# Altium schematic sheet VoiceRecorderSchematic.SchDoc: Voice Recorder
size A; Date: 09/08/2021; CompanyName: Group-24; DrawnBy: Thanushan K., Nisitha Maneesha,; DocumentNumber: Voice Recorder PCB; Revision: 1; SheetNumber: 1
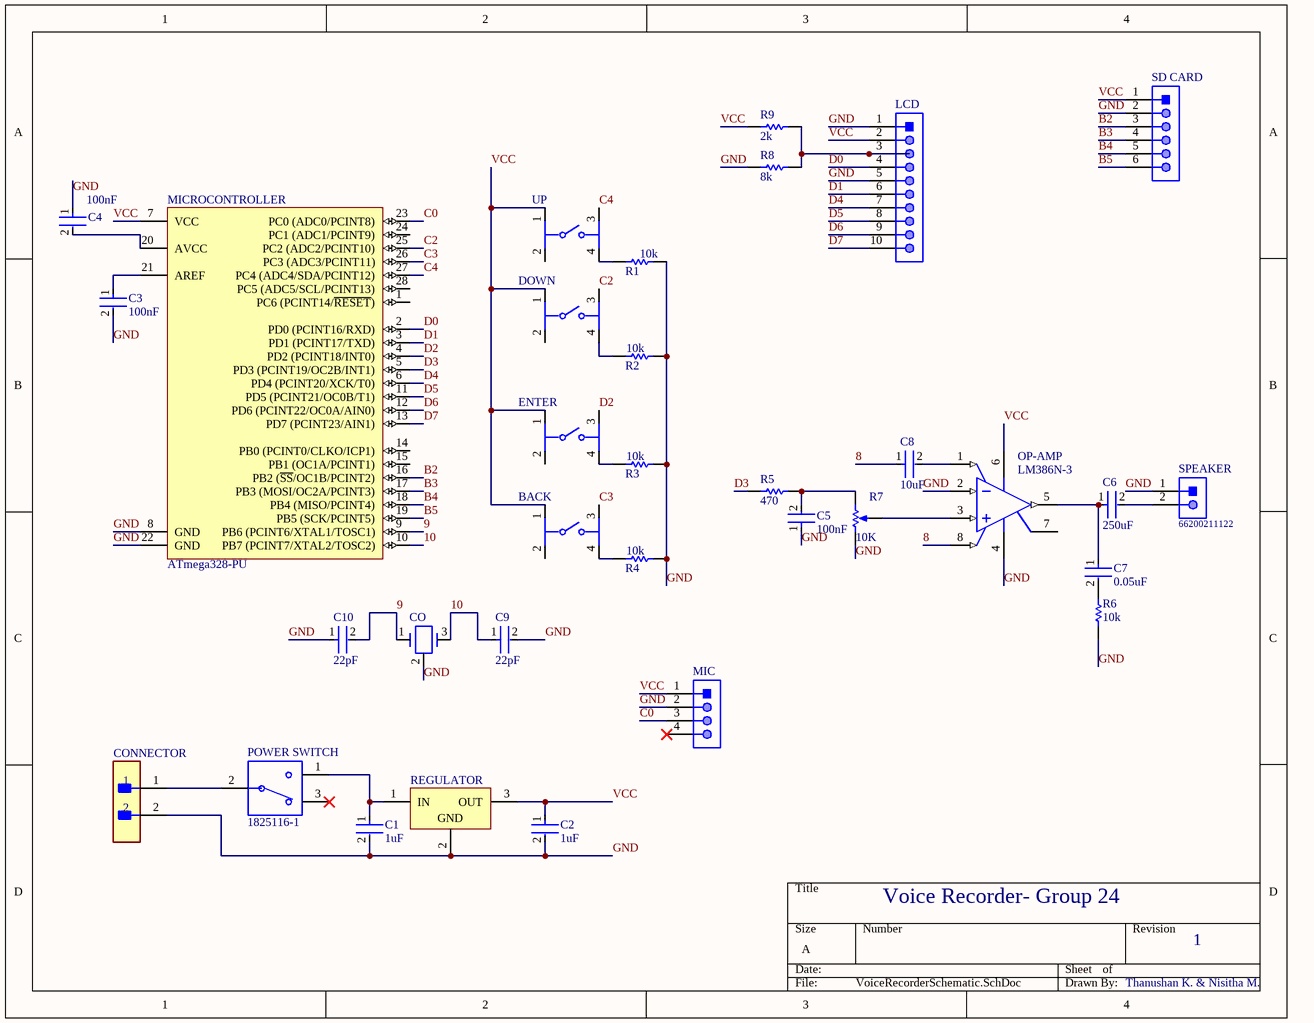
[diagram p0: VoiceRecorderSchematic.SchDoc]

## Parts
BACK  3-1825910-1  [FP-3-1825910-1-MFG]  (value not drawn)
C1  1uF  [FP-C440-MFG]
C2  1uF  [FP-C440-MFG]
C3  100nF  [FP-C440-MFG]
C4  100nF  [FP-C440-MFG]
C5  100nF  [FP-C440-MFG]
C6  250uF  [FP-C440-MFG]
C7  0.05uF  [FP-C440-MFG]
C8  10uF  [FP-C440-MFG]
C9  22pF  [FP-C440-MFG]
C10  22pF  [FP-C440-MFG]
CO  ECS-200-20-4X  [ECS-4X-3IL]  (value not drawn)
CONNECTOR  350428-1  [FP-350428-1-MFG]  (value not drawn)
DOWN  3-1825910-1  [FP-3-1825910-1-MFG]  (value not drawn)
ENTER  3-1825910-1  [FP-3-1825910-1-MFG]  (value not drawn)
LCD  66201011122  [66201011122]  (value not drawn)
MIC  66200411122  [66200411122]  (value not drawn)
MICROCONTROLLER  ATmega328-PU  [28P3]
OP-AMP  LM386N-3  [TI-P8]
POWER_SWITCH  1825116-1  [SW_1825116-1]
R1  10k  [OMTE-RES7X2.5-2]
R2  10k  [OMTE-RES7X2.5-2]
R3  10k  [OMTE-RES7X2.5-2]
R4  10k  [OMTE-RES7X2.5-2]
R5  470  [OMTE-RES7X2.5-2]
R6  10k  [OMTE-RES7X2.5-2]
R7  value 10K  [VR5]  (hidden comment: RPot)
R8  8k  [OMTE-RES7X2.5-2]
R9  2k  [OMTE-RES7X2.5-2]
REGULATOR  L7805CV  [TO220]  (value not drawn)
SD_CARD  66200611122  [66200611122]  (value not drawn)
SPEAKER  66200211122  [66200211122]
UP  3-1825910-1  [FP-3-1825910-1-MFG]  (value not drawn)

## Nets
8: C8.1 OP-AMP.8(GAIN)
9: C10.2 CO.1 MICROCONTROLLER.9(PB6_(PCINT6/XTAL1/TOSC1))
10: C9.1 CO.3 MICROCONTROLLER.10(PB7_(PCINT7/XTAL2/TOSC2))
B2: MICROCONTROLLER.16(PB2_(~{SS}/OC1B/PCINT2)) SD_CARD.3
B3: MICROCONTROLLER.17(PB3_(MOSI/OC2A/PCINT3)) SD_CARD.4
B4: MICROCONTROLLER.18(PB4_(MISO/PCINT4)) SD_CARD.5
B5: MICROCONTROLLER.19(PB5_(SCK/PCINT5)) SD_CARD.6
C0: MIC.3 MICROCONTROLLER.23(PC0_(ADC0/PCINT8))
C2: DOWN.3 MICROCONTROLLER.25(PC2_(ADC2/PCINT10))
C3: BACK.3 MICROCONTROLLER.26(PC3_(ADC3/PCINT11))
C4: MICROCONTROLLER.27(PC4_(ADC4/SDA/PCINT12)) UP.3
D0: LCD.4 MICROCONTROLLER.2(PD0_(PCINT16/RXD))
D1: LCD.6 MICROCONTROLLER.3(PD1_(PCINT17/TXD))
D2: ENTER.3 MICROCONTROLLER.4(PD2_(PCINT18/INT0))
D3: MICROCONTROLLER.5(PD3_(PCINT19/OC2B/INT1)) R5.2
D4: LCD.7 MICROCONTROLLER.6(PD4_(PCINT20/XCK/T0))
D5: LCD.8 MICROCONTROLLER.11(PD5_(PCINT21/OC0B/T1))
D6: LCD.9 MICROCONTROLLER.12(PD6_(PCINT22/OC0A/AIN0))
D7: LCD.10 MICROCONTROLLER.13(PD7_(PCINT23/AIN1))
GND: C1.2 C2.2 C3.2 C4.1 C5.1 C9.2 C10.1 CO.2 CONNECTOR.2 LCD.1 LCD.5 MIC.2 MICROCONTROLLER.8(GND) MICROCONTROLLER.22(GND) OP-AMP.2(IN-) OP-AMP.4(GND) R1.1 R2.1 R3.1 R4.1 R6.1 R7.1(TOP) R8.2 REGULATOR.2(GND) SD_CARD.2 SPEAKER.1
VCC: BACK.1 C2.1 DOWN.1 ENTER.1 LCD.2 MIC.1 MICROCONTROLLER.7(VCC) OP-AMP.6(VS) R9.2 REGULATOR.3(OUT) SD_CARD.1 UP.1
NetBACK_4: BACK.4 R4.2
NetC1_1: C1.1 POWER_SWITCH.1 REGULATOR.1(IN)
NetC3_1: C3.1 MICROCONTROLLER.21(AREF)
NetC4_2: C4.2 MICROCONTROLLER.20(AVCC)
NetC5_2: C5.2 R5.1 R7.2(BOT)
NetC6_1: C6.1 C7.1 OP-AMP.5(VOUT)
NetC6_2: C6.2 SPEAKER.2
NetC7_2: C7.2 R6.2
NetC8_2: C8.2 OP-AMP.1(GAIN)
NetCONNECTOR_1: CONNECTOR.1 POWER_SWITCH.2
NetDOWN_4: DOWN.4 R2.2
NetENTER_4: ENTER.4 R3.2
NetLCD_3: LCD.3 R8.1 R9.1
NetOP-AMP_3: OP-AMP.3(IN+) R7.3(TAP)
NetR1_2: R1.2 UP.4

Not connected (* = marked no-connect by the designer): BACK 2; DOWN 2; ENTER 2; MIC 4*; MICROCONTROLLER 1(PC6_(PCINT14/~{RESET})) 14(PB0_(PCINT0/CLKO/ICP1)) 15(PB1_(OC1A/PCINT1)) 24(PC1_(ADC1/PCINT9)) 28(PC5_(ADC5/SCL/PCINT13)); OP-AMP 7(BYPASS); POWER_SWITCH 3*; UP 2

## Notes on the sheet
- Voice Recorder- Group 24
- 1
- Thanushan K. & Nisitha M.

## Library data of the parts
BACK DOWN ENTER UP = CMP-03407-000001-1: SWITCH TACTILE SPST-NO 0.05A 24V; Manufacturer: TE Connectivity; Operating Force: 160gf; Contact Current Rating: 50mA; Contact Resistance: 100mΩ; Electromechanical Life: 100000Cycles; Device Class L1: Electromechanical; ComponentLink2URL: https://www.te.com/commerce/DocumentDelivery/DDEController?Action=srchrtrv&DocNm=1825910&DocType=Customer+Drawing&DocLang=English; Category: Switch; Device Class L2: Switches; Temperature: -35°C to +85°C; RoHS: TRUE; Mount: Through Hole; Manufacturer Part Number: 3-1825910-1; Automotive: No; Lead Free: Yes; Device Class L3: Tactile Switches; ComponentLink2Description: Datasheet; Temperature Range High: +85°C; Height: 17.3mm; Package: 0; Temperature Range Low: -35°C; Throw Configuration: SPST-NO; Digikey Description: SWITCH TACTILE SPST-NO 0.05A 24V; Octopart: https://octopart.com/3-1825910-1-te+connectivity-46506874
C1-C10 = CMP-03020-013956-1: CAP CER 1UF 50V Z5U AXIAL; Manufacturer Part Number: C440C105M5U5TA7200; Manufacturer: Kemet; Material: Ceramic; Tolerance: 20%; Mouser Description: Multilayer Ceramic Capacitors MLCC - Leaded 50volts 1uF 20%; Temperature Range High: +85°C; Lead Free: Yes; Height: 3.81mm; Category: Cap; ComponentLink2Description: Datasheet; Temperature: -10°C to +85°C; Ipc Land Pattern Name: CAPAD1043W70L736D381; Device Class L3: Ceramic Capacitors; Octopart: https://octopart.com/c440c105m5u5ta7200-kemet-193612; RoHS: TRUE; Automotive: No; Temperature Characteristic: Z5U; ComponentLink2URL: https://content.kemet.com/datasheets/KEM_C1042_AXIMAX_Z5U.pdf; Value: 1uF; Package: C440; Temperature Range Low: -10°C; Capacitance: 1uF; Device Class L2: Capacitors; Device Class L1: Passive Components; Digikey Description: CAP CER 1UF 50V Z5U AXIAL; Voltage Rating: 50V
CO = CMP-1669-00001-2: CRYSTAL 20.000MHZ 20PF 49US; Manufacturer: ECS; ComponentLink1URL: http://www.ecsxtal.com/store/pdf/hc-49usx.pdf; PartNumber: ECS-200-20-4X; ComponentLink1Description: Datasheet; PackageReference: 4X-3IL
CONNECTOR = CMP-03369-000080-1: CONN HEADER VERT 2POS 6.35MM; Manufacturer: TE Connectivity; Standoff Height: 0.63mm; Number Of Contacts: 2; Conn Gender: Male; Voltage Rating: 600V; Conn Orientation: Vertical; Current Rating: 12A; Number Of Rows: 1; Mouser Description: Connector, Soft Shell; Universal MATE-N-LOK; 2; Nylon; Natural; 19 A; 600 VAC; Height: 14.99mm; Pitch: 6.35mm; ComponentLink2URL: https://www.te.com/commerce/DocumentDelivery/DDEController?Action=showdoc&DocId=Customer+Drawing%7F350428%7FY2%7Fpdf%7FEnglish%7FENG_CD_350428_Y2.pdf%7F350428-1; Device Class L1: Connectors; Automotive: No; Octopart: https://octopart.com/350428-1-te+connectivity-46505355; Digikey Description: CONN HEADER VERT 2POS 6.35MM; RoHS: TRUE; Temperature: -40°C to +105°C; Contact Material: Gold,Nickel; Package: 350428-1; Temperature Range Low: -40°C; Device Class L3: unset; Lead Free: Yes; Device Class L2: Headers and Wire Housings; Category: Conn; ComponentLink2Description: Datasheet; Temperature Range High: +105°C; Manufacturer Part Number: 350428-1
LCD = CMP-1502-00448-1: THT Male Header WR-MPC3, Vertical, Single Row, pitch 3 mm, 10 pins; Manufacturer: Wurth Elektronik; Working Voltage: 250VAC; Pitch: 3mm; Contact Resistance: 10mOhm; Pin Number: 10; Manufacturer URL: http://www.we-online.de; Packaging: Tube; Part Number: 66201011122; Datasheet URL: https://katalog.we-online.de/em/datasheet/6620xx11122.pdf; Orientation: Vertical; Publisher: WurthElektronik; Package Reference: 66201011122; Operating Temperature: -40to105degC; Mounting Technology: THT; Gender: Male
MIC = CMP-1502-00442-1: THT Male Header WR-MPC3, Vertical, Single Row, pitch 3 mm, 4 pins; Manufacturer: Wurth Elektronik; Contact Resistance: 10mOhm; Working Voltage: 250VAC; Pin Number: 4; Pitch: 3mm; Manufacturer URL: http://www.we-online.de; Package Reference: 66200411122; Packaging: Tube; Part Number: 66200411122; Publisher: WurthElektronik; Orientation: Vertical; Mounting Technology: THT; Gender: Male; Operating Temperature: -40to105degC; Datasheet URL: https://katalog.we-online.de/em/datasheet/6620xx11122.pdf
MICROCONTROLLER = CMP-0095-00015-2: 8-bit AVR Microcontroller, 32KB Flash, 1KB EEPROM, 2KB SRAM, 28-pin PDIP, Industrial Grade (-40°C to 85°C); ComponentLink3Description: ATmega48A/48PA/88A/88PA/168A/168PA/328/328P Summary; RevisionNote: DatasheetVersion updated. URLs added.; DatasheetVersion: revD, May-2011; ComponentLink1URL: http://www.atmel.com/; PackageVersion: revB, Sep-2001; PackageDescription: 28-lead (0.300"/7.62mm Wide) Plastic Dual Inline Package (PDIP); PackageReference: 28P3; ComponentLink1Description: Manufacturer URL; ComponentLink2Description: ATmega48A/48PA/88A/88PA/168A/168PA/328/328P Datasheet; ComponentLink3URL: http://www.atmel.com/dyn/resources/prod_documents/8271S.pdf; ComponentLink2URL: http://www.atmel.com/dyn/resources/prod_documents/8271.pdf
OP-AMP = CMP-0057-00053-3: Low Voltage Audio Power Amplifier, 0 to 70 degC, 8-pin DIP (P8); Manufacturer: Texas Instruments; SubFamily: Mid/High-Power Amplifier; Input Type: Analog; Max. Number of Speaker Outputs: 1; ComponentLink1Description: Manufacturer URL; ComponentLink2Description: Datasheet; ComponentLink2URL: http://www.ti.com/general/docs/lit/getliterature.tsp?genericPartNumber=LM386&fileType=pdf; Code_JEDEC: MS-001; ComponentLink3URL: http://www.ti.com/litv/pdf/mpdi001b; Mounting Technology: Through Hole; PartNumber: LM386N-3; PackageVersion: 4040082/E, 04/2010; ComponentLink1URL: http://www.ti.com/; DatasheetVersion: SNAS545A; ComponentLink3Description: Package Specification; PackageDescription: 8-Pin Plastic In-Line, Body 9.59 x 6.35 mm, Pitch 2.54 mm; PackageReference: P8
POWER_SWITCH = 1825116-1: Slide Switch SPDT Through Hole, Right Angle; MF: TE Connectivity; Price: None; Value: *; EU_RoHS_Compliance: Compliant; MP: 1825116-1; Package: None; TE_purchase_URL: https://www.te.com/usa-en/product-1825116-1.html?te_bu=Cor&te_type=disp&te_campaign=seda_glo_cor-seda-global-disp-prtnr-fy19-seda-model-bom-cta_sma-317_1&elqCampaignId=32493; SnapEDA_Link: https://www.snapeda.com/parts/1825116-1/TE%20Connectivity%20ALCOSWITCH%20Switches/view-part/497270/?ref=snap; Availability: Unavailable
R1-R4 R6 = CMP-2000-06865-1: Little Demon(R) Carbon Composition Molded OD Series, 250 V, 10 KOhm, +/-5%, -70 to 130 degC, 2-Pin THD, RoHS, Bulk; PartNumber: OD103JE; Manufacturer: Ohmite; Power Rating: 0.25W; Power (Watts): 0.25W,1/4W; Tolerance: ±5%; Online Catalog: OD,OF,OASeries,LittleDemon®; Catalog Drawings: OD,OF,OASeries; EDA / CAD Models: DownloadfromAcceleratedDesigns; Mounting Technology: ThroughHole; Datasheet Version: 06/2016; RoHS Information: LittleDemon"E"SeriesMaterialDeclaration; Number of Terminations: 2; Temperature Coefficient: -; Height: -; Resistance (Ohms): 10k; Composition: CarbonComposition; Package Description: 2-Pin THD Resistor, Body 7 x 2.5 mm, Lead Dia. 0.6 mm; Size / Dimension: 0.098"Diax0.276"L(2.50mmx7.00mm); Category: Resistors; Manufacturer URL: http://www.ohmite.com/; Features: PulseWithstanding; Family: ThroughHoleResistors; Supplier Device Package: Axial; Package / Case: Axial; Standard Package: 100; Package Reference: RES7X2.5; Operating Temperature: -; Series: LittleDemon®OD; Datasheet URL: http://www.ohmite.com/cat/res_od_of_oa.pdf; Packaging: Bulk
R5 R8 R9 = CMP-2000-06865-1: Little Demon(R) Carbon Composition Molded OD Series, 250 V, 10 KOhm, +/-5%, -70 to 130 degC, 2-Pin THD, RoHS, Bulk; PartNumber: OD103JE; Manufacturer: Ohmite; Resistance (Ohms): 10k; Power Rating: 0.25W; Power (Watts): 0.25W,1/4W; Tolerance: ±5%; Online Catalog: OD,OF,OASeries,LittleDemon®; Catalog Drawings: OD,OF,OASeries; EDA / CAD Models: DownloadfromAcceleratedDesigns; Mounting Technology: ThroughHole; Datasheet Version: 06/2016; RoHS Information: LittleDemon"E"SeriesMaterialDeclaration; Number of Terminations: 2; Temperature Coefficient: -; Height: -; Composition: CarbonComposition; Package Description: 2-Pin THD Resistor, Body 7 x 2.5 mm, Lead Dia. 0.6 mm; Size / Dimension: 0.098"Diax0.276"L(2.50mmx7.00mm); Category: Resistors; Manufacturer URL: http://www.ohmite.com/; Features: PulseWithstanding; Family: ThroughHoleResistors; Supplier Device Package: Axial; Package / Case: Axial; Standard Package: 100; Package Reference: RES7X2.5; Operating Temperature: -; Series: LittleDemon®OD; Datasheet URL: http://www.ohmite.com/cat/res_od_of_oa.pdf; Packaging: Bulk
R7 = RPot: Potentiometer; Sim Note: Enter the Resistance value and the set point into parameter fields.; Set Position: 0.5; Published: 8-Jun-2000; LatestRevisionDate: 17-Jul-2002; LatestRevisionNote: Re-released for DXP Platform.; PackageReference: VR5; Publisher: Altium Limited; PackageDescription: Variable Resistor, Thru-Hole; 3 Leads
REGULATOR = CMP-0244-00483-1: Positive Voltage Regulator, 5V, 3-Pin TO-220; PackageDescription: TO, Thru-Hole, Vertical, Heatsink Mounted; 3 In-Line Leads; Pitch 2.54 mm; ComponentLink2Description: Datasheet; PackageReference: TO220; ComponentLink3URL: http://www.st.com/internet/com/TECHNICAL_RESOURCES/TECHNICAL_LITERATURE/PACKAGE_INFORMATION/CD00004649.pdf; DatasheetVersion: 16/11/2011; ComponentLink1Description: Manufacturer URL; ComponentLink1URL: http://www.st.com; PackageVersion: ver3.0; ComponentLink3Description: Package Specification; ComponentLink2URL: http://www.st.com/internet/com/TECHNICAL_RESOURCES/TECHNICAL_LITERATURE/DATASHEET/CD00000444.pdf
SD_CARD = CMP-1502-00444-1: THT Male Header WR-MPC3, Vertical, Single Row, pitch 3 mm, 6 pins; Manufacturer: Wurth Elektronik; Working Voltage: 250VAC; Contact Resistance: 10mOhm; Pin Number: 6; Pitch: 3mm; Package Reference: 66200611122; Manufacturer URL: http://www.we-online.de; Packaging: Tube; Operating Temperature: -40to105degC; Publisher: WurthElektronik; Datasheet URL: https://katalog.we-online.de/em/datasheet/6620xx11122.pdf; Mounting Technology: THT; Gender: Male; Part Number: 66200611122; Orientation: Vertical
SPEAKER = CMP-1502-00440-1: THT Male Header WR-MPC3, Vertical, Single Row, pitch 3 mm, 2 pins; Manufacturer: Wurth Elektronik; Contact Resistance: 10mOhm; Pin Number: 2; Working Voltage: 250VAC; Pitch: 3mm; Orientation: Vertical; Mounting Technology: THT; Packaging: Tube; Publisher: WurthElektronik; Operating Temperature: -40to105degC; Datasheet URL: https://katalog.we-online.de/em/datasheet/6620xx11122.pdf; Manufacturer URL: http://www.we-online.de; Part Number: 66200211122; Gender: Male; Package Reference: 66200211122